# Altium schematic sheet RST.SchDoc
size A4
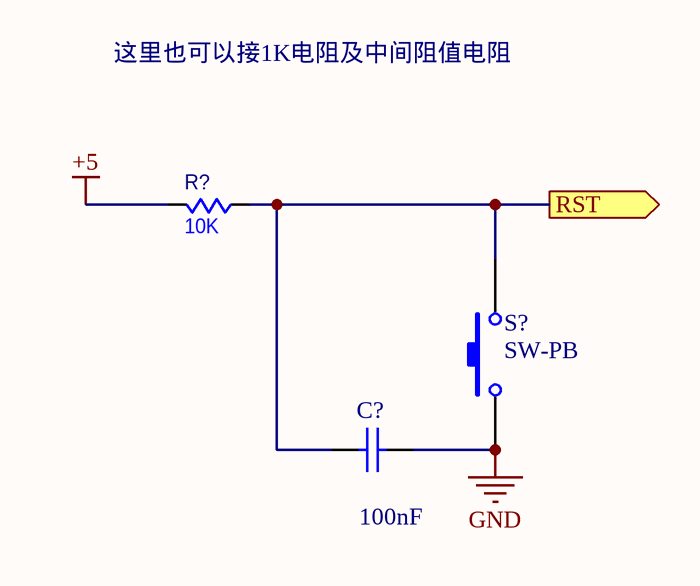
[diagram p0: RST.SchDoc]

## Parts
C?  value 100nF  [0603]  (hidden comment: Cap)
R?  value 10K  [0603]  (hidden comment: Res)
S?  SW-PB  [SW_PB2_C1]

## Ports
RST (out)

## Nets
+5: R?.2
GND: C?.2 S?.1
RST: C?.1 R?.1 S?.2 ; port RST

## Notes on the sheet
- 这里也可以接1K电阻及中间阻值电阻

## Library data of the parts
C? = Cap: 无极性电容; Published: 8-Jun-2000; LatestRevisionDate: 17-Jul-2002; LatestRevisionNote: Re-released for DXP Platform.; PackageReference: RAD-0.3; Publisher: Altium Limited
R? = Res: 常规电阻
S? = SW-PB: 微动开关; Published: 24-Mar-1999; LatestRevisionDate: 17-Jul-2002; LatestRevisionNote: Re-released for DXP Platform.; PackageReference: SPST-2; Publisher: Altium Limited